# EAGLE design uServer-2.2 (EAGLE 6.5.0)
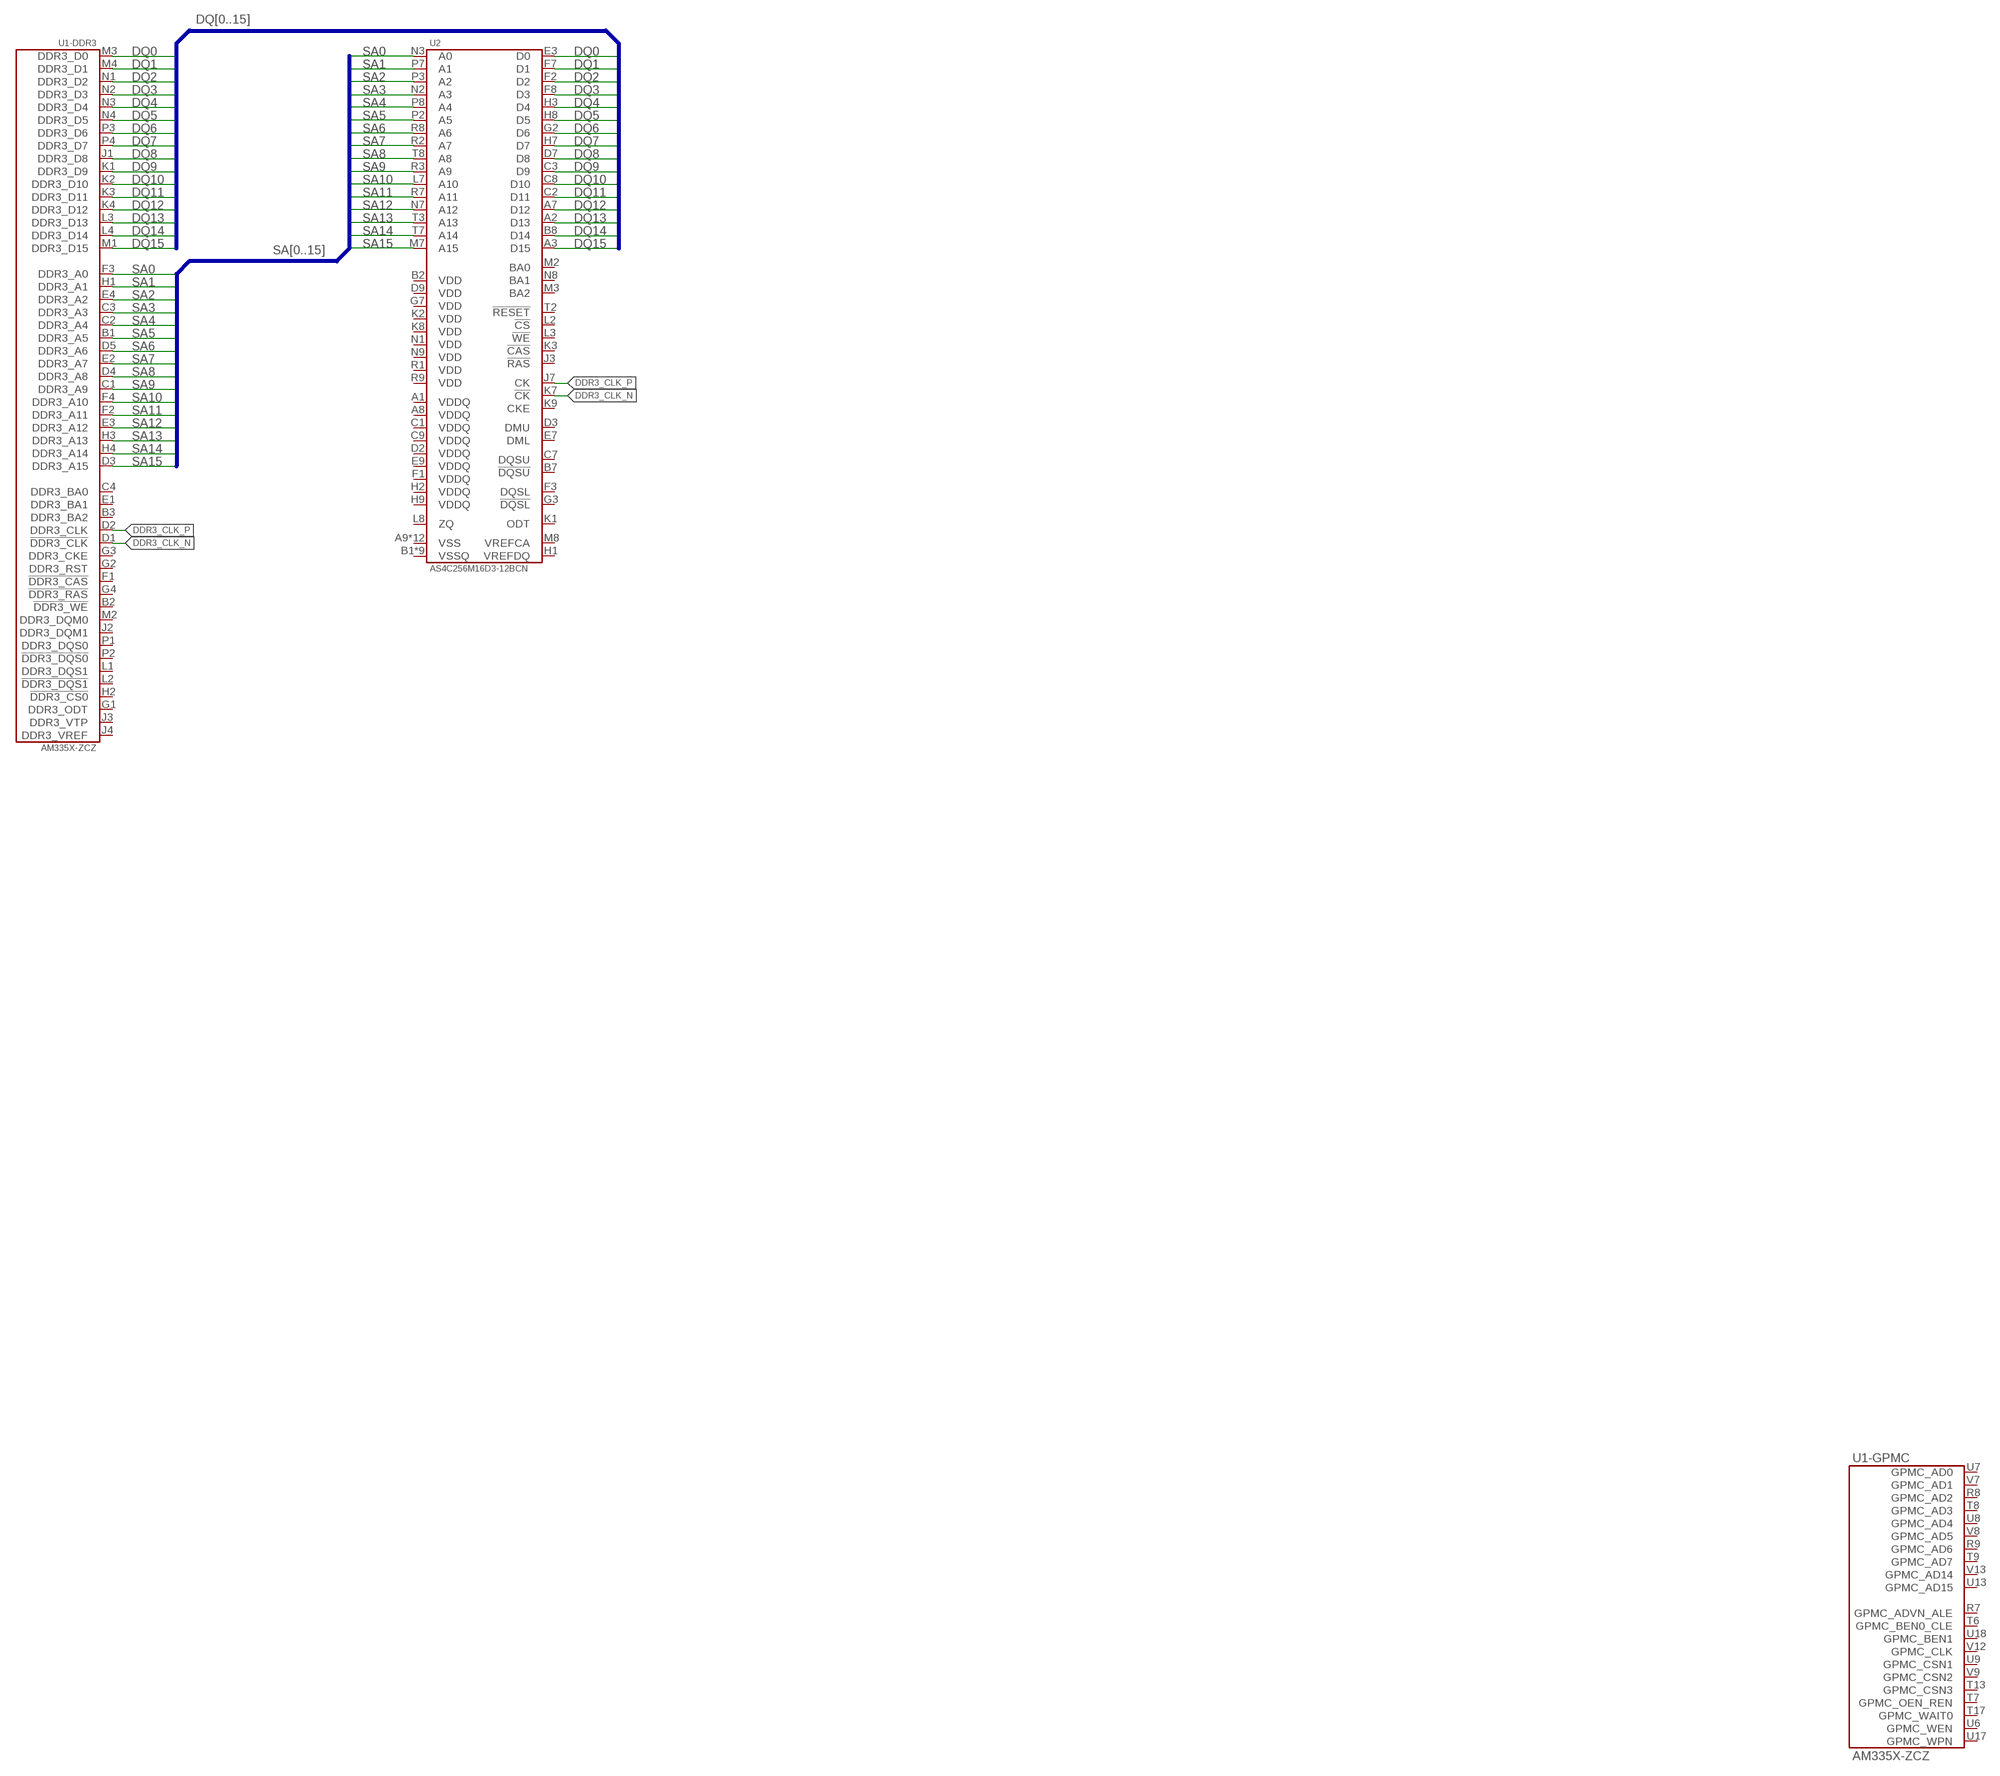
[diagram p0: schematic, sheet 1, part 1 of 2]
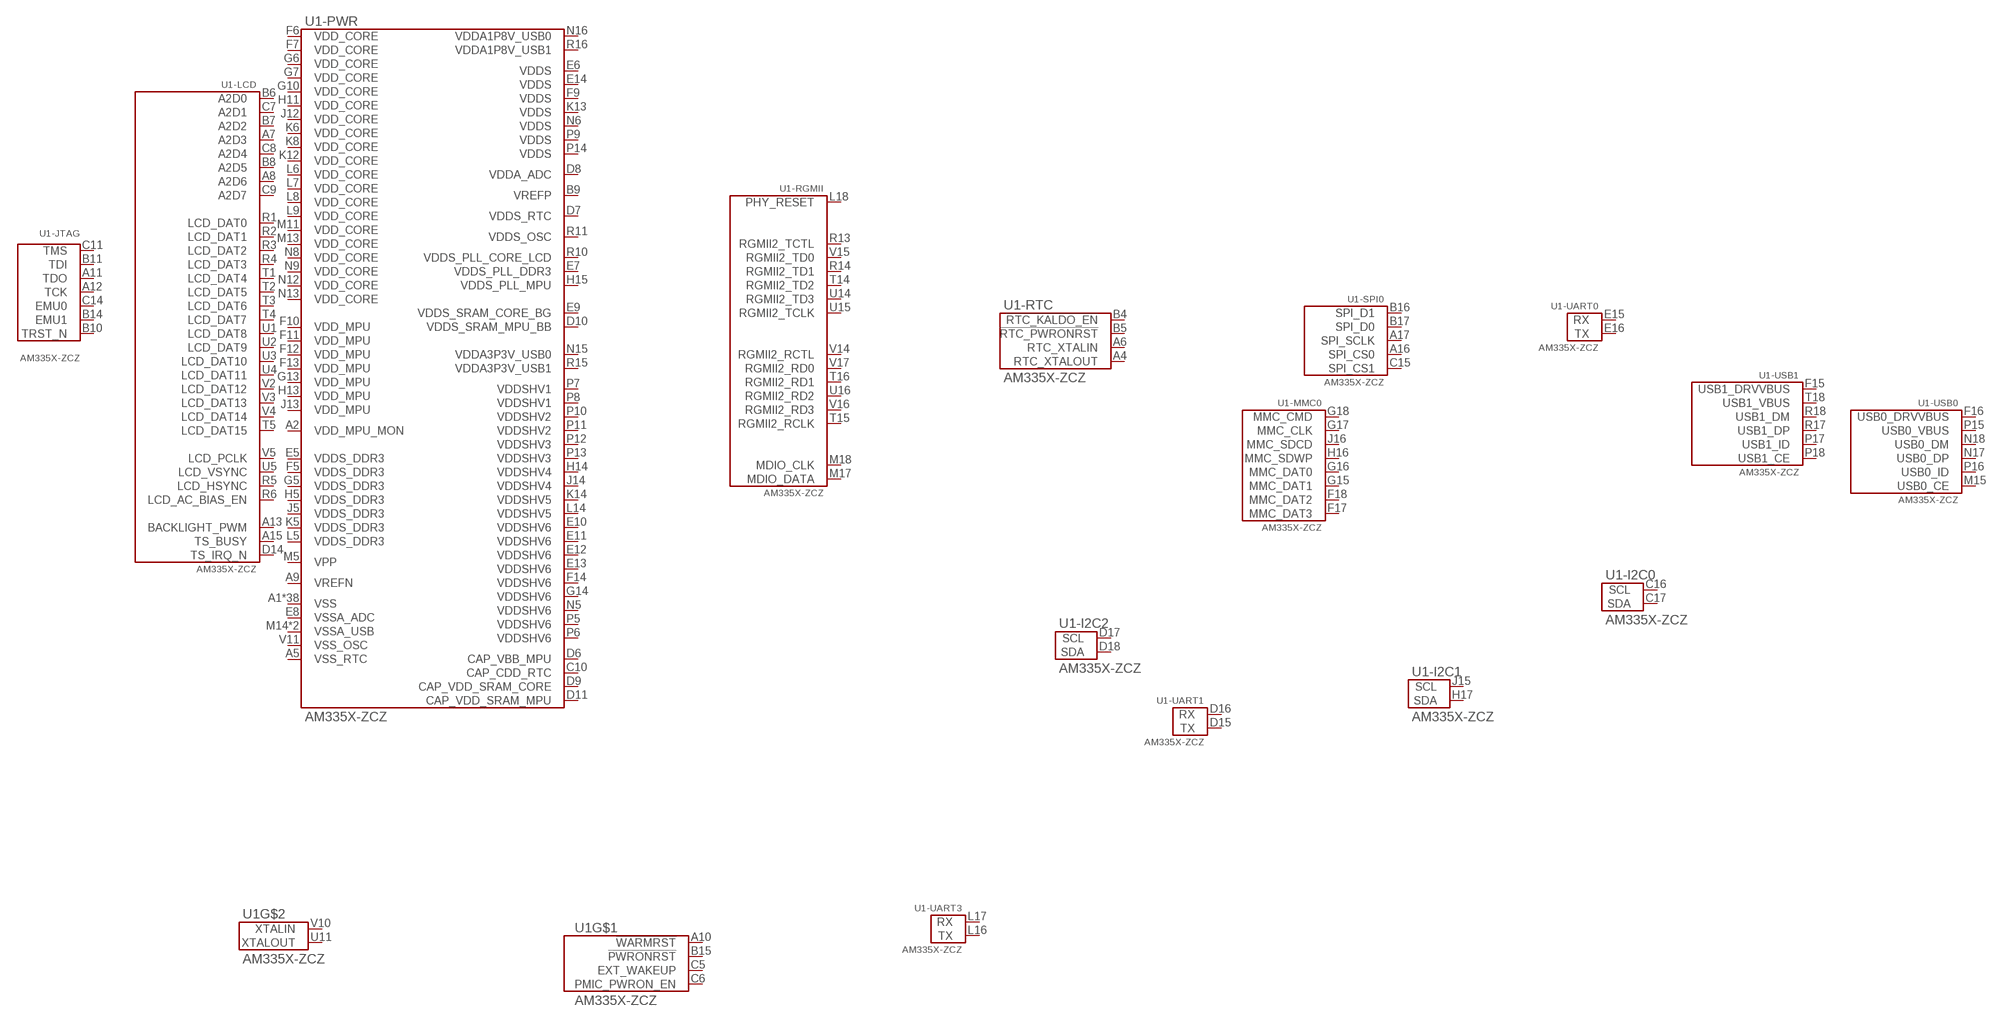
[diagram p1: schematic, sheet 1, part 2 of 2]

## Parts
U1  AM335X-ZCZ  [AM335X-ZCZ]
U2  AS4C256M16D3-12BCN  [DDR3-16]

## Nets
DDR3_CLK_N: U1.D1(-DDR3:!DDR3_CLK) U2.K7(!CK)
DDR3_CLK_P: U1.D2(-DDR3:DDR3_CLK) U2.J7(CK)
DQ0: U1.M3(-DDR3:DDR3_D0) U2.E3(D0)
DQ1: U1.M4(-DDR3:DDR3_D1) U2.F7(D1)
DQ2: U1.N1(-DDR3:DDR3_D2) U2.F2(D2)
DQ3: U1.N2(-DDR3:DDR3_D3) U2.F8(D3)
DQ4: U1.N3(-DDR3:DDR3_D4) U2.H3(D4)
DQ5: U1.N4(-DDR3:DDR3_D5) U2.H8(D5)
DQ6: U1.P3(-DDR3:DDR3_D6) U2.G2(D6)
DQ7: U1.P4(-DDR3:DDR3_D7) U2.H7(D7)
DQ8: U1.J1(-DDR3:DDR3_D8) U2.D7(D8)
DQ9: U1.K1(-DDR3:DDR3_D9) U2.C3(D9)
DQ10: U1.K2(-DDR3:DDR3_D10) U2.C8(D10)
DQ11: U1.K3(-DDR3:DDR3_D11) U2.C2(D11)
DQ12: U1.K4(-DDR3:DDR3_D12) U2.A7(D12)
DQ13: U1.L3(-DDR3:DDR3_D13) U2.A2(D13)
DQ14: U1.L4(-DDR3:DDR3_D14) U2.B8(D14)
DQ15: U1.M1(-DDR3:DDR3_D15) U2.A3(D15)
SA0: U1.F3(-DDR3:DDR3_A0) U2.N3(A0)
SA1: U1.H1(-DDR3:DDR3_A1) U2.P7(A1)
SA2: U1.E4(-DDR3:DDR3_A2) U2.P3(A2)
SA3: U1.C3(-DDR3:DDR3_A3) U2.N2(A3)
SA4: U1.C2(-DDR3:DDR3_A4) U2.P8(A4)
SA5: U1.B1(-DDR3:DDR3_A5) U2.P2(A5)
SA6: U1.D5(-DDR3:DDR3_A6) U2.R8(A6)
SA7: U1.E2(-DDR3:DDR3_A7) U2.R2(A7)
SA8: U1.D4(-DDR3:DDR3_A8) U2.T8(A8)
SA9: U1.C1(-DDR3:DDR3_A9) U2.R3(A9)
SA10: U1.F4(-DDR3:DDR3_A10) U2.L7(A10)
SA11: U1.F2(-DDR3:DDR3_A11) U2.R7(A11)
SA12: U1.E3(-DDR3:DDR3_A12) U2.N7(A12)
SA13: U1.H3(-DDR3:DDR3_A13) U2.T3(A13)
SA14: U1.H4(-DDR3:DDR3_A14) U2.T7(A14)
SA15: U1.D3(-DDR3:DDR3_A15) U2.M7(A15)
Unconnected: U1.A1(-PWR:VSS) U1.A2(-PWR:VDD_MPU_MON) U1.A4(-RTC:RTC_XTALOUT) U1.A5(-PWR:VSS_RTC) U1.A6(-RTC:RTC_XTALIN) U1.A7(-LCD:A2D3) U1.A8(-LCD:A2D6) U1.A9(-PWR:VREFN) U1.A10(!WARMRST) U1.A11(-JTAG:TDO) U1.A12(-JTAG:TCK) U1.A13(-LCD:BACKLIGHT_PWM) U1.A15(-LCD:TS_BUSY) U1.A16(-SPI0:SPI_CS0) U1.A17(-SPI0:SPI_SCLK) U1.A18(-PWR:VSS) U1.B2(-DDR3:!DDR3_WE) U1.B3(-DDR3:DDR3_BA2) U1.B4(-RTC:!RTC_KALDO_EN) U1.B5(-RTC:!RTC_PWRONRST) U1.B6(-LCD:A2D0) U1.B7(-LCD:A2D2) U1.B8(-LCD:A2D5) U1.B9(-PWR:VREFP) U1.B10(-JTAG:TRST_N) U1.B11(-JTAG:TDI) U1.B14(-JTAG:EMU1) U1.B15(!PWRONRST) U1.B16(-SPI0:SPI_D1) U1.B17(-SPI0:SPI_D0) U1.C4(-DDR3:DDR3_BA0) U1.C5(EXT_WAKEUP) U1.C6(PMIC_PWRON_EN) U1.C7(-LCD:A2D1) U1.C8(-LCD:A2D4) U1.C9(-LCD:A2D7) U1.C10(-PWR:CAP_CDD_RTC) U1.C11(-JTAG:TMS) U1.C14(-JTAG:EMU0) U1.C15(-SPI0:SPI_CS1) U1.C16(-I2C0:SCL) U1.C17(-I2C0:SDA) U1.D6(-PWR:CAP_VBB_MPU) U1.D7(-PWR:VDDS_RTC) U1.D8(-PWR:VDDA_ADC) U1.D9(-PWR:CAP_VDD_SRAM_CORE) U1.D10(-PWR:VDDS_SRAM_MPU_BB) U1.D11(-PWR:CAP_VDD_SRAM_MPU) U1.D14(-LCD:TS_IRQ_N) U1.D15(-UART1:TX) U1.D16(-UART1:RX) U1.D17(-I2C2:SCL) U1.D18(-I2C2:SDA) U1.E1(-DDR3:DDR3_BA1) U1.E5(-PWR:VDDS_DDR3) U1.E6(-PWR:VDDS) U1.E7(-PWR:VDDS_PLL_DDR3) U1.E8(-PWR:VSSA_ADC) U1.E9(-PWR:VDDS_SRAM_CORE_BG) U1.E10(-PWR:VDDSHV6) U1.E11(-PWR:VDDSHV6) U1.E12(-PWR:VDDSHV6) U1.E13(-PWR:VDDSHV6) U1.E14(-PWR:VDDS) U1.E15(-UART0:RX) U1.E16(-UART0:TX) U1.F1(-DDR3:!DDR3_CAS) U1.F5(-PWR:VDDS_DDR3) U1.F6(-PWR:VDD_CORE) U1.F7(-PWR:VDD_CORE) U1.F8(-PWR:VSS) U1.F9(-PWR:VDDS) U1.F10(-PWR:VDD_MPU) U1.F11(-PWR:VDD_MPU) U1.F12(-PWR:VDD_MPU) U1.F13(-PWR:VDD_MPU) U1.F14(-PWR:VDDSHV6) U1.F15(-USB1:USB1_DRVVBUS) U1.F16(-USB0:USB0_DRVVBUS) U1.F17(-MMC0:MMC_DAT3) U1.F18(-MMC0:MMC_DAT2) U1.G1(-DDR3:DDR3_ODT) U1.G2(-DDR3:DDR3_RST) U1.G3(-DDR3:DDR3_CKE) U1.G4(-DDR3:!DDR3_RAS) U1.G5(-PWR:VDDS_DDR3) U1.G6(-PWR:VDD_CORE) U1.G7(-PWR:VDD_CORE) U1.G8(-PWR:VSS) U1.G9(-PWR:VSS) U1.G10(-PWR:VDD_CORE) U1.G11(-PWR:VSS) U1.G12(-PWR:VSS) U1.G13(-PWR:VDD_MPU) U1.G14(-PWR:VDDSHV6) U1.G15(-MMC0:MMC_DAT1) U1.G16(-MMC0:MMC_DAT0) U1.G17(-MMC0:MMC_CLK) U1.G18(-MMC0:MMC_CMD) U1.H2(-DDR3:!DDR3_CS0) U1.H5(-PWR:VDDS_DDR3) U1.H6(-PWR:VSS) U1.H7(-PWR:VSS) U1.H8(-PWR:VSS) U1.H9(-PWR:VSS) U1.H10(-PWR:VSS) U1.H11(-PWR:VDD_CORE) U1.H12(-PWR:VSS) U1.H13(-PWR:VDD_MPU) U1.H14(-PWR:VDDSHV4) U1.H15(-PWR:VDDS_PLL_MPU) U1.H16(-MMC0:MMC_SDWP) U1.H17(-I2C1:SDA) U1.J2(-DDR3:DDR3_DQM1) U1.J3(-DDR3:DDR3_VTP) U1.J4(-DDR3:DDR3_VREF) U1.J5(-PWR:VDDS_DDR3) U1.J6(-PWR:VSS) U1.J7(-PWR:VSS) U1.J8(-PWR:VSS) U1.J9(-PWR:VSS) U1.J10(-PWR:VSS) U1.J11(-PWR:VSS) U1.J12(-PWR:VDD_CORE) U1.J13(-PWR:VDD_MPU) U1.J14(-PWR:VDDSHV4) U1.J15(-I2C1:SCL) U1.J16(-MMC0:MMC_SDCD) U1.K5(-PWR:VDDS_DDR3) U1.K6(-PWR:VDD_CORE) U1.K7(-PWR:VSS) U1.K8(-PWR:VDD_CORE) U1.K9(-PWR:VSS) U1.K10(-PWR:VSS) U1.K11(-PWR:VSS) U1.K12(-PWR:VDD_CORE) U1.K13(-PWR:VDDS) U1.K14(-PWR:VDDSHV5) U1.L1(-DDR3:DDR3_DQS1) U1.L2(-DDR3:!DDR3_DQS1) U1.L5(-PWR:VDDS_DDR3) U1.L6(-PWR:VDD_CORE) U1.L7(-PWR:VDD_CORE) U1.L8(-PWR:VDD_CORE) U1.L9(-PWR:VDD_CORE) U1.L10(-PWR:VSS) U1.L11(-PWR:VSS) U1.L12(-PWR:VSS) U1.L13(-PWR:VSS) U1.L14(-PWR:VDDSHV5) U1.L16(-UART3:TX) U1.L17(-UART3:RX) U1.L18(-RGMII:PHY_RESET) U1.M2(-DDR3:DDR3_DQM0) U1.M5(-PWR:VPP) U1.M6(-PWR:VSS) U1.M7(-PWR:VSS) U1.M8(-PWR:VSS) U1.M9(-PWR:VSS) U1.M10(-PWR:VSS) U1.M11(-PWR:VDD_CORE) U1.M12(-PWR:VSS) U1.M13(-PWR:VDD_CORE) U1.M14(-PWR:VSSA_USB) U1.M15(-USB0:USB0_CE) U1.M17(-RGMII:MDIO_DATA) U1.M18(-RGMII:MDIO_CLK) U1.N5(-PWR:VDDSHV6) U1.N6(-PWR:VDDS) U1.N7(-PWR:VSS) U1.N8(-PWR:VDD_CORE) U1.N9(-PWR:VDD_CORE) U1.N10(-PWR:VSS) U1.N11(-PWR:VSS) U1.N12(-PWR:VDD_CORE) U1.N13(-PWR:VDD_CORE) U1.N14(-PWR:VSSA_USB) U1.N15(-PWR:VDDA3P3V_USB0) U1.N16(-PWR:VDDA1P8V_USB0) U1.N17(-USB0:USB0_DP) U1.N18(-USB0:USB0_DM) U1.P1(-DDR3:DDR3_DQS0) U1.P2(-DDR3:!DDR3_DQS0) U1.P5(-PWR:VDDSHV6) U1.P6(-PWR:VDDSHV6) U1.P7(-PWR:VDDSHV1) U1.P8(-PWR:VDDSHV1) U1.P9(-PWR:VDDS) U1.P10(-PWR:VDDSHV2) U1.P11(-PWR:VDDSHV2) U1.P12(-PWR:VDDSHV3) U1.P13(-PWR:VDDSHV3) U1.P14(-PWR:VDDS) U1.P15(-USB0:USB0_VBUS) U1.P16(-USB0:USB0_ID) U1.P17(-USB1:USB1_ID) U1.P18(-USB1:USB1_CE) U1.R1(-LCD:LCD_DAT0) U1.R2(-LCD:LCD_DAT1) U1.R3(-LCD:LCD_DAT2) U1.R4(-LCD:LCD_DAT3) U1.R5(-LCD:LCD_HSYNC) U1.R6(-LCD:LCD_AC_BIAS_EN) U1.R7(-GPMC:GPMC_ADVN_ALE) U1.R8(-GPMC:GPMC_AD2) U1.R9(-GPMC:GPMC_AD6) U1.R10(-PWR:VDDS_PLL_CORE_LCD) U1.R11(-PWR:VDDS_OSC) U1.R13(-RGMII:RGMII2_TCTL) U1.R14(-RGMII:RGMII2_TD1) U1.R15(-PWR:VDDA3P3V_USB1) U1.R16(-PWR:VDDA1P8V_USB1) U1.R17(-USB1:USB1_DP) U1.R18(-USB1:USB1_DM) U1.T1(-LCD:LCD_DAT4) U1.T2(-LCD:LCD_DAT5) U1.T3(-LCD:LCD_DAT6) U1.T4(-LCD:LCD_DAT7) U1.T5(-LCD:LCD_DAT15) U1.T6(-GPMC:GPMC_BEN0_CLE) U1.T7(-GPMC:GPMC_OEN_REN) U1.T8(-GPMC:GPMC_AD3) U1.T9(-GPMC:GPMC_AD7) U1.T13(-GPMC:GPMC_CSN3) U1.T14(-RGMII:RGMII2_TD2) U1.T15(-RGMII:RGMII2_RCLK) U1.T16(-RGMII:RGMII2_RD1) U1.T17(-GPMC:GPMC_WAIT0) U1.T18(-USB1:USB1_VBUS) U1.U1(-LCD:LCD_DAT8) U1.U2(-LCD:LCD_DAT9) U1.U3(-LCD:LCD_DAT10) U1.U4(-LCD:LCD_DAT11) U1.U5(-LCD:LCD_VSYNC) U1.U6(-GPMC:GPMC_WEN) U1.U7(-GPMC:GPMC_AD0) U1.U8(-GPMC:GPMC_AD4) U1.U9(-GPMC:GPMC_CSN1) U1.U11(XTALOUT) U1.U13(-GPMC:GPMC_AD15) U1.U14(-RGMII:RGMII2_TD3) U1.U15(-RGMII:RGMII2_TCLK) U1.U16(-RGMII:RGMII2_RD2) U1.U17(-GPMC:GPMC_WPN) U1.U18(-GPMC:GPMC_BEN1) U1.V1(-PWR:VSS) U1.V2(-LCD:LCD_DAT12) U1.V3(-LCD:LCD_DAT13) U1.V4(-LCD:LCD_DAT14) U1.V5(-LCD:LCD_PCLK) U1.V7(-GPMC:GPMC_AD1) U1.V8(-GPMC:GPMC_AD5) U1.V9(-GPMC:GPMC_CSN2) U1.V10(XTALIN) U1.V11(-PWR:VSS_OSC) U1.V12(-GPMC:GPMC_CLK) U1.V13(-GPMC:GPMC_AD14) U1.V14(-RGMII:RGMII2_RCTL) U1.V15(-RGMII:RGMII2_TD0) U1.V16(-RGMII:RGMII2_RD3) U1.V17(-RGMII:RGMII2_RD0) U1.V18(-PWR:VSS) U2.A1(VDDQ) U2.A8(VDDQ) U2.A9(VSS) U2.B1(VSSQ) U2.B2(VDD) U2.B3(VSS) U2.B7(!DQSU) U2.B9(VSSQ) U2.C1(VDDQ) U2.C7(DQSU) U2.C9(VDDQ) U2.D1(VSSQ) U2.D2(VDDQ) U2.D3(DMU) U2.D8(VSSQ) U2.D9(VDD) U2.E1(VSS) U2.E2(VSSQ) U2.E7(DML) U2.E8(VSSQ) U2.E9(VDDQ) U2.F1(VDDQ) U2.F3(DQSL) U2.F9(VSSQ) U2.G1(VSSQ) U2.G3(!DQSL) U2.G7(VDD) U2.G8(VSS) U2.G9(VSSQ) U2.H1(VREFDQ) U2.H2(VDDQ) U2.H9(VDDQ) U2.J2(VSS) U2.J3(!RAS) U2.J8(VSS) U2.K1(ODT) U2.K2(VDD) U2.K3(!CAS) U2.K8(VDD) U2.K9(CKE) U2.L2(!CS) U2.L3(!WE) U2.L8(ZQ) U2.M1(VSS) U2.M2(BA0) U2.M3(BA2) U2.M8(VREFCA) U2.M9(VSS) U2.N1(VDD) U2.N8(BA1) U2.N9(VDD) U2.P1(VSS) U2.P9(VSS) U2.R1(VDD) U2.R9(VDD) U2.T1(VSS) U2.T2(!RESET) U2.T9(VSS)

## Buses
DQ[0..15]
SA[0..15]

## Library data of the parts
U1 = TI:AM335X
U2 = AllianceMemory:AS4C256M16D3

## Board
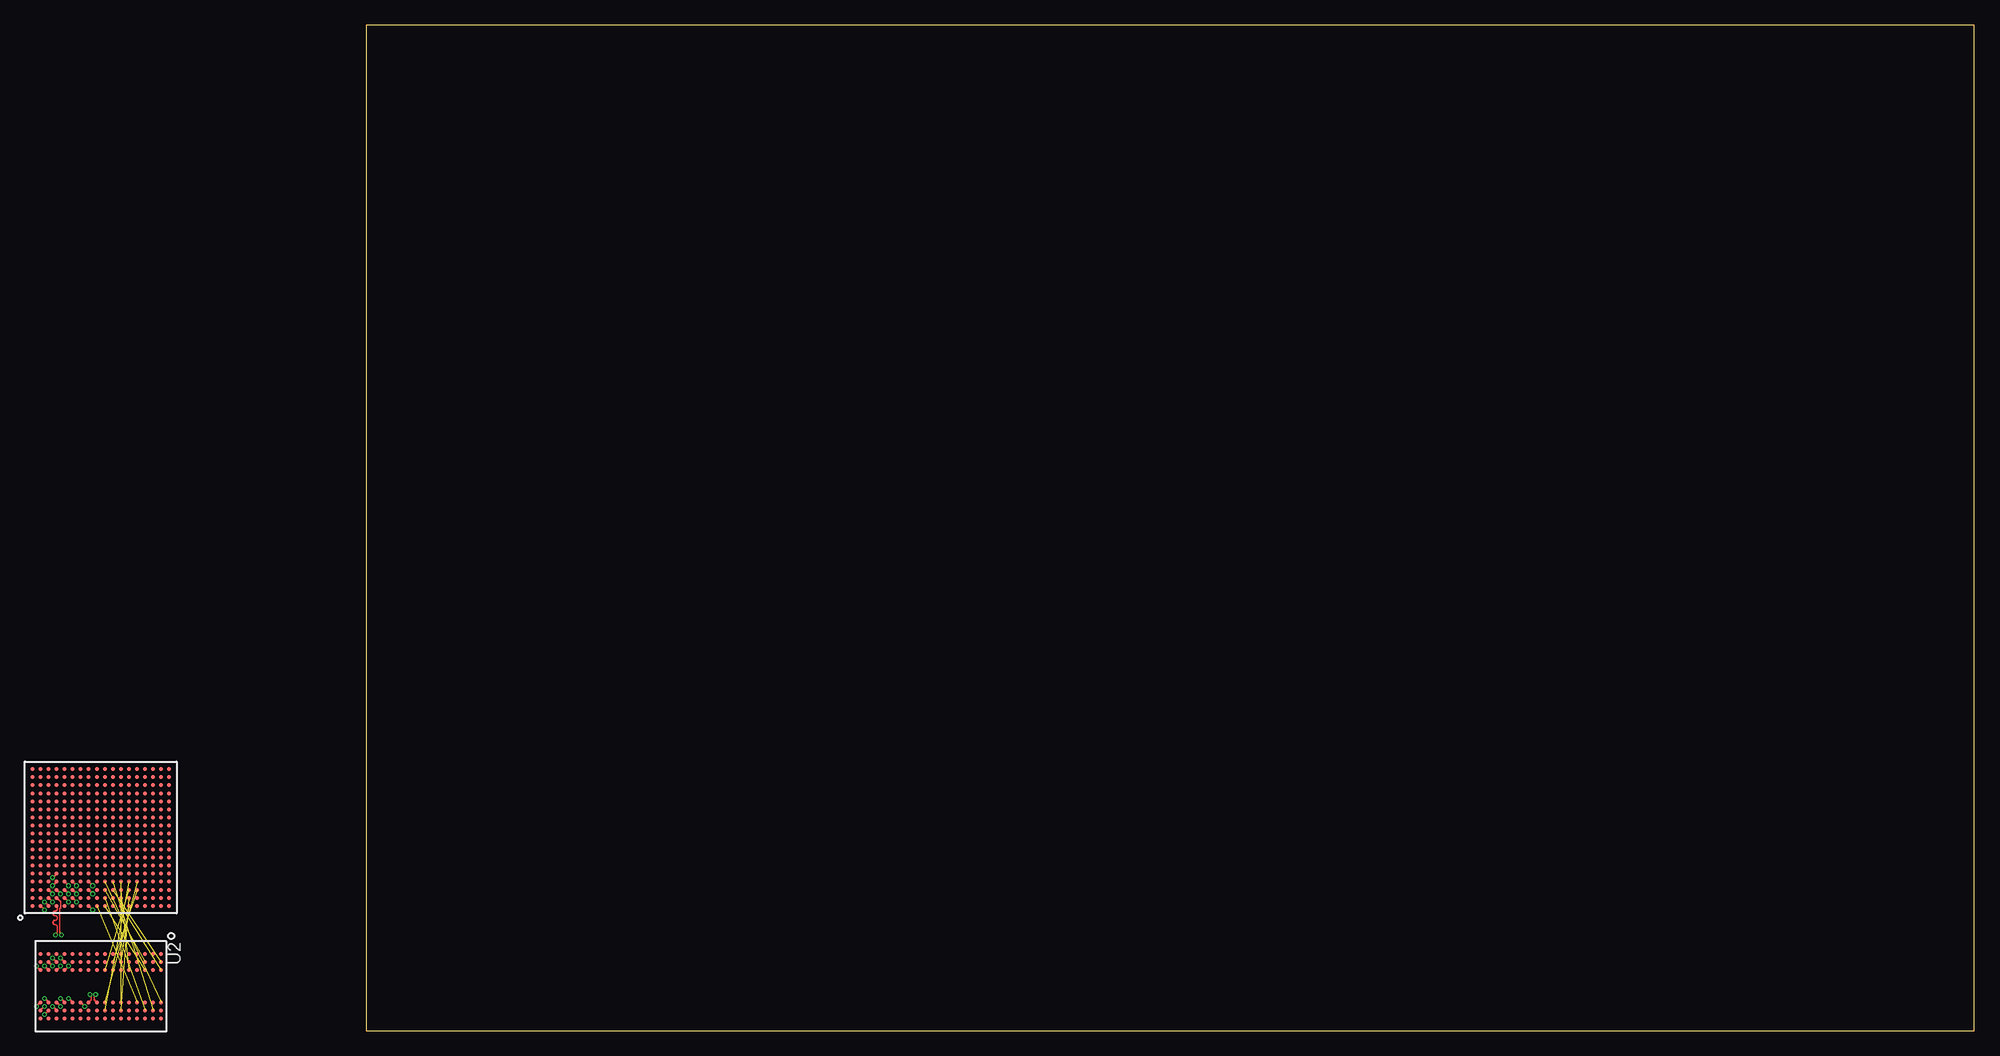
[diagram p2: board, top side]
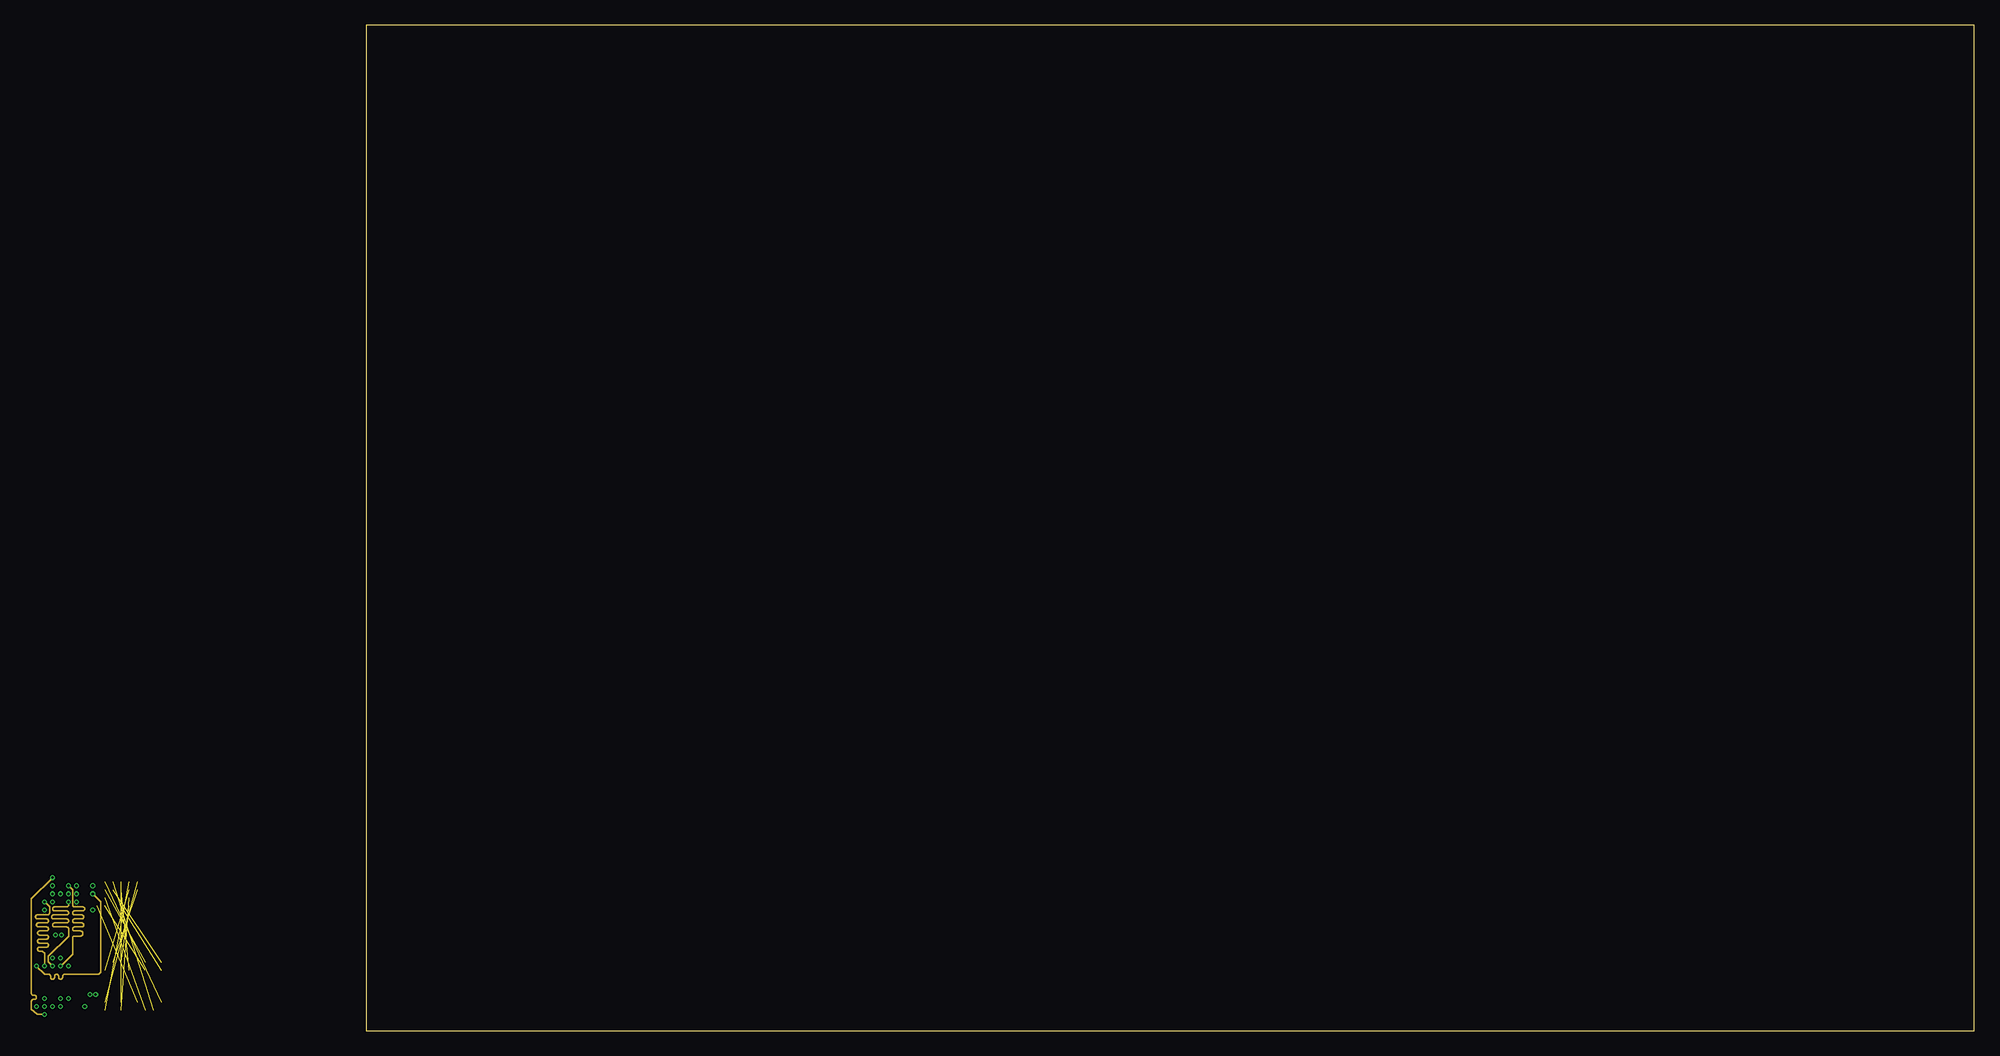
[diagram p3: board, inner layer Route2]
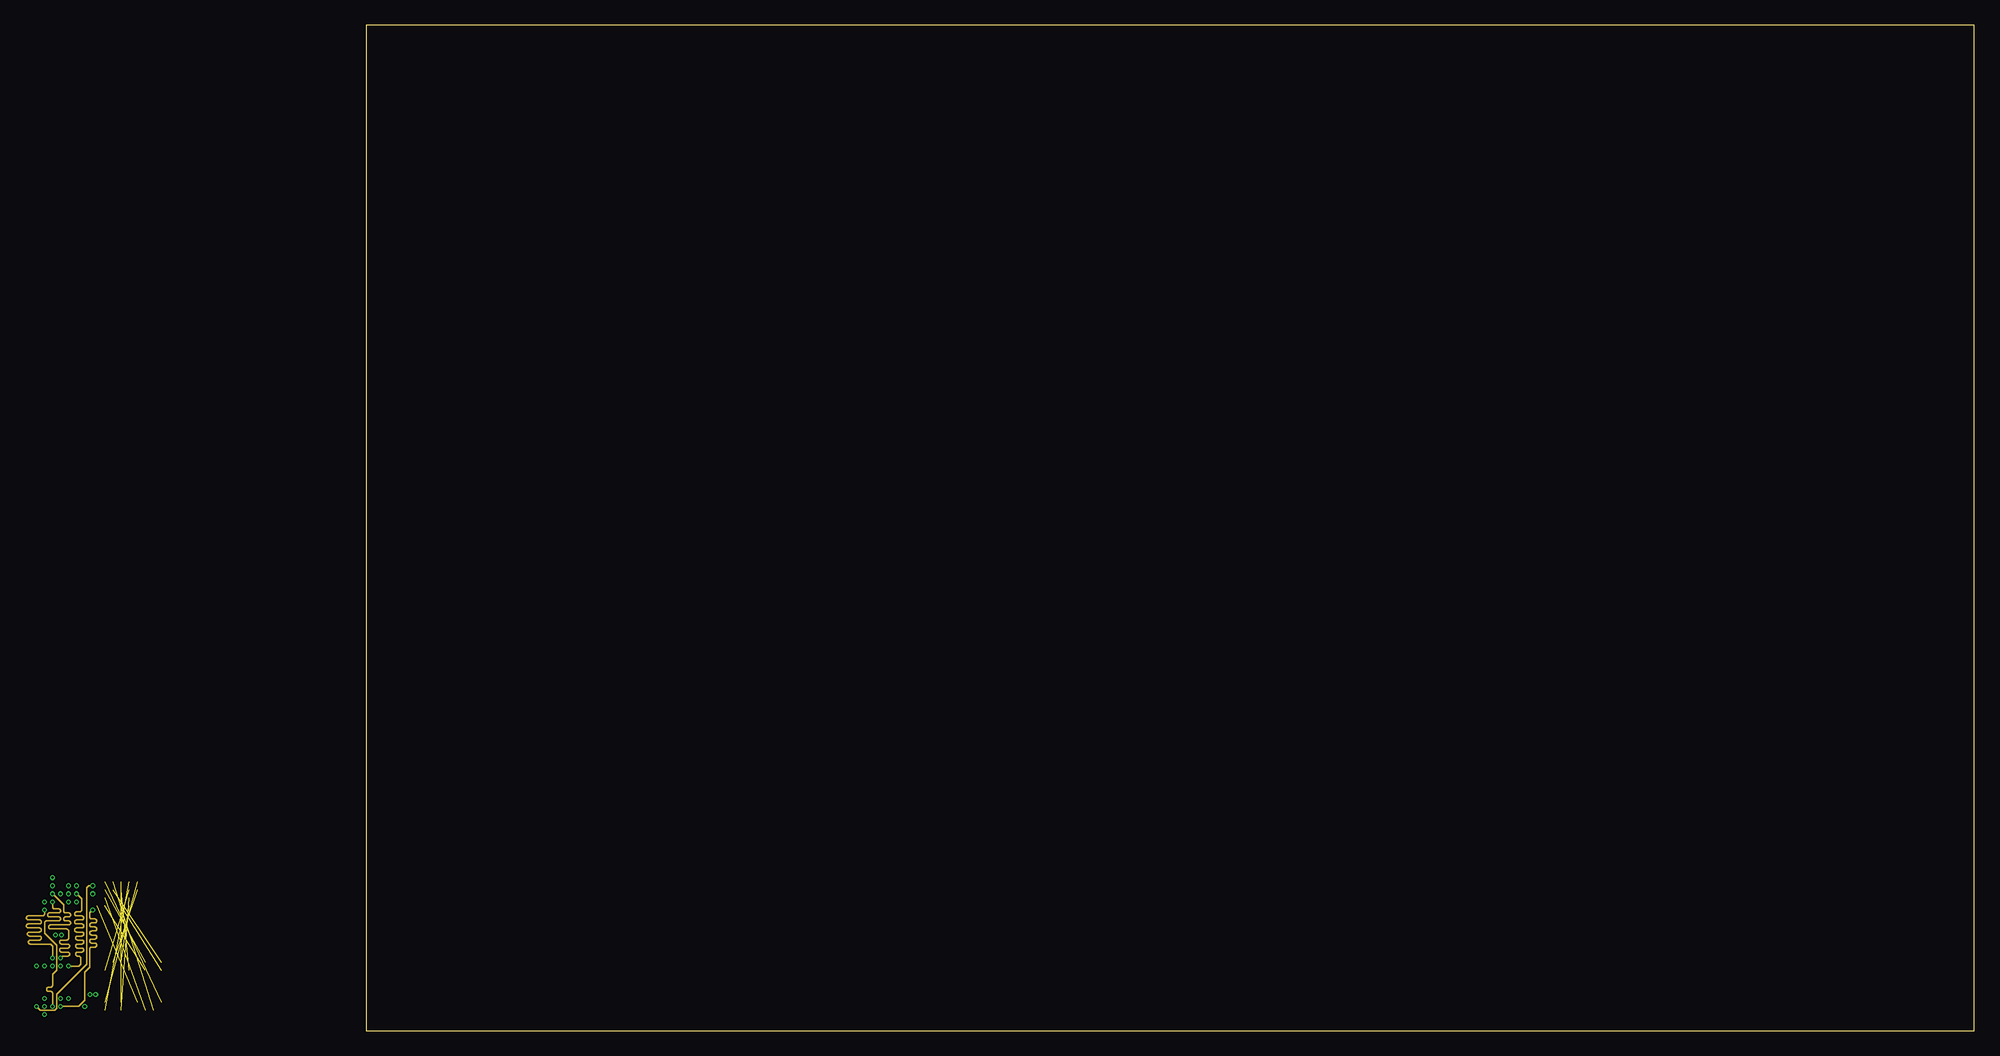
[diagram p4: board, inner layer Route15]
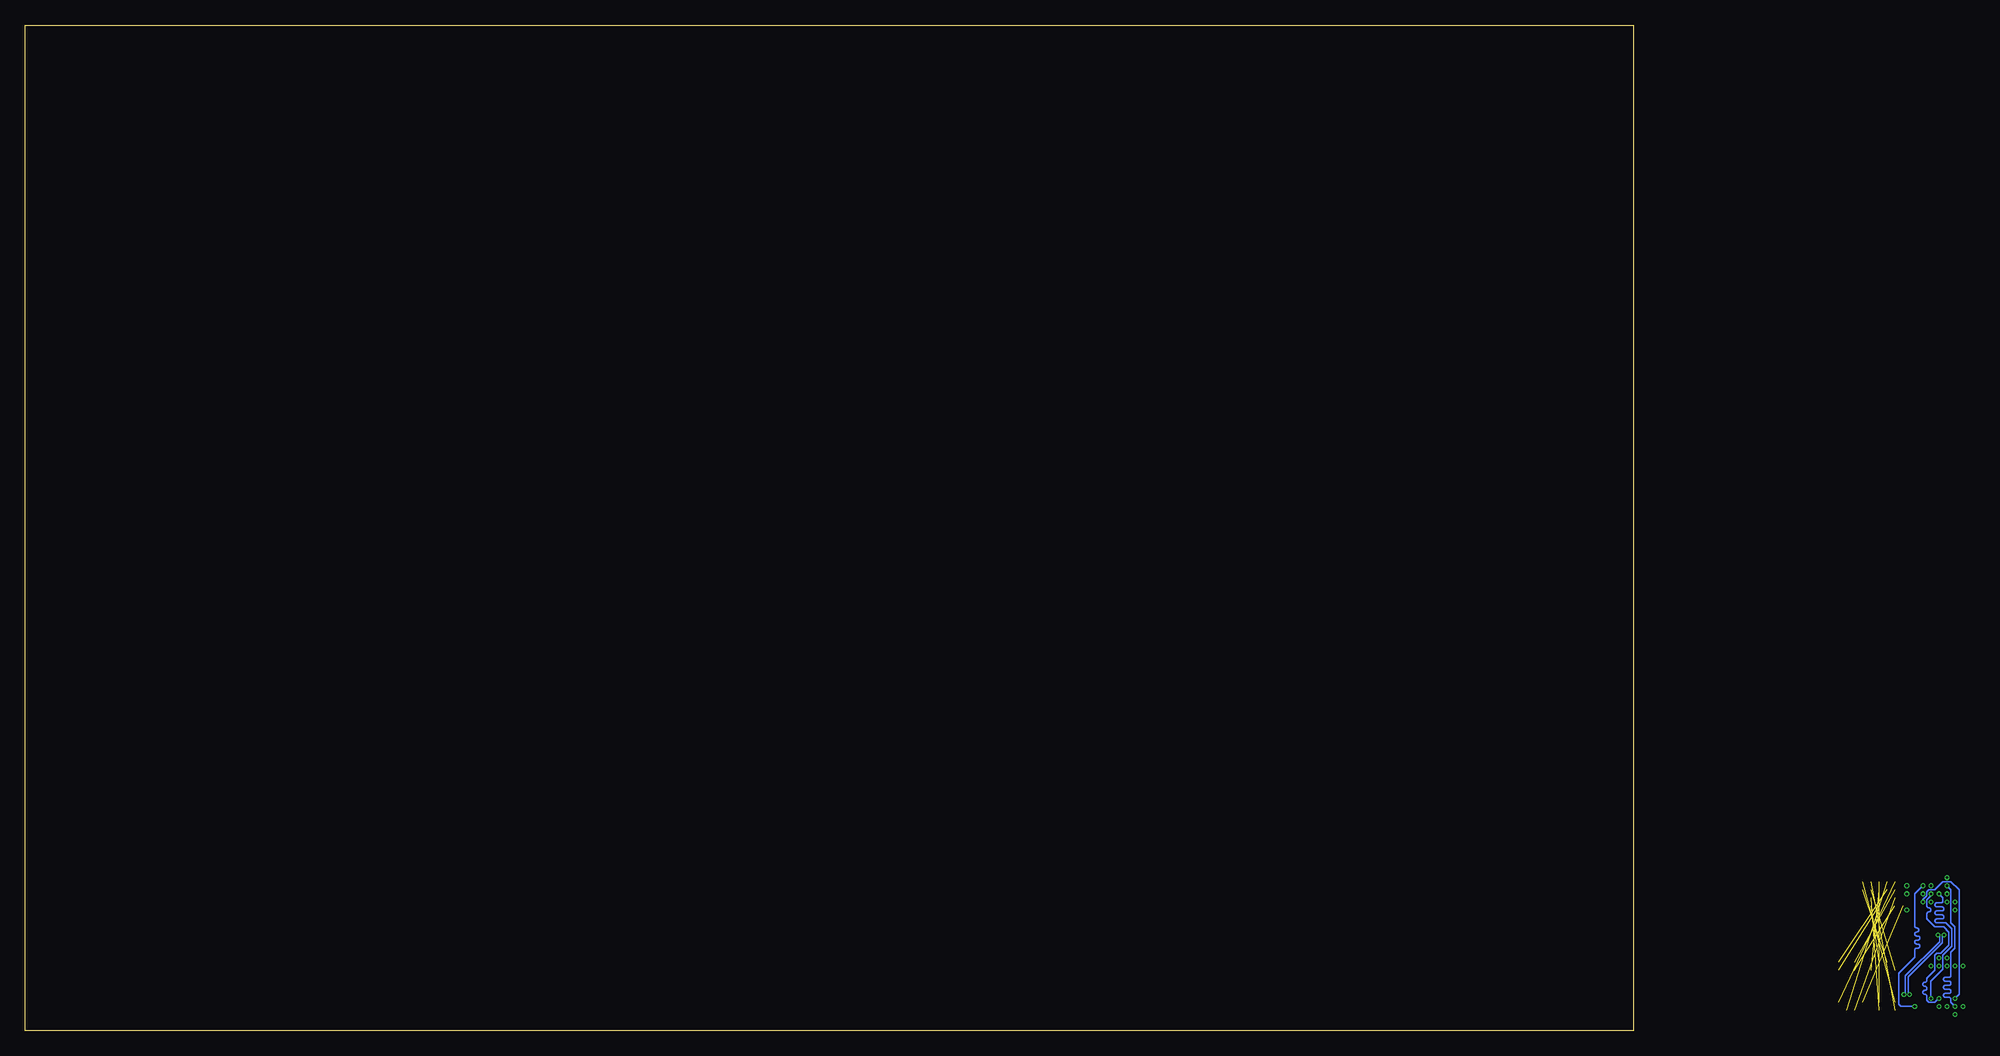
[diagram p5: board, bottom side, seen from below]

Size 160 x 100 mm. Coordinates in mm from the lower left corner, seen from the top.
Outline: 0,0 160,0 160,100 0,100 0,0
Copper layers (1*2*15*16): Top 0.035559375mm / dielectric 0.17018125mm / Route2 0.01778125mm / dielectric 47mil / Route15 0.01778125mm / dielectric 0.17018125mm / Bottom 0.035559375mm
Design rules "OSHPark-4layer *": minimum track width 5mil, minimum drill 10mil, track to track 5mil, track to pad 5mil, pad to pad 5mil, via to via 5mil, smd to smd 5mil, copper to edge 15mil, drill to drill 6mil, minimum pad ring 4mil, minimum via ring 4mil, stop-mask expansion 4mil, vias tented up to drill 20mil, thermal gap 10mil

### Footprints (pad centres in the part's own frame; a part is rotated, then mirrored left to right if it is on the bottom)
AM335X-ZCZ = smd 0.4 x 0.4: A1 -6.8,6.8; A2 -6,6.8; A3 -5.2,6.8; A4 -4.4,6.8; A5 -3.6,6.8; A6 -2.8,6.8; A7 -2,6.8; A8 -1.2,6.8; A9 -0.4,6.8; A10 0.4,6.8; A11 1.2,6.8; A12 2,6.8; A13 2.8,6.8; A14 3.6,6.8; A15 4.4,6.8; A16 5.2,6.8; A17 6,6.8; A18 6.8,6.8; B1 -6.8,6; B2 -6,6; B3 -5.2,6; B4 -4.4,6; B5 -3.6,6; B6 -2.8,6; B7 -2,6; B8 -1.2,6; B9 -0.4,6; B10 0.4,6; B11 1.2,6; B12 2,6; B13 2.8,6; B14 3.6,6; B15 4.4,6; B16 5.2,6; B17 6,6; B18 6.8,6; C1 -6.8,5.2; C2 -6,5.2; C3 -5.2,5.2; C4 -4.4,5.2; C5 -3.6,5.2; C6 -2.8,5.2; C7 -2,5.2; C8 -1.2,5.2; C9 -0.4,5.2; C10 0.4,5.2; C11 1.2,5.2; C12 2,5.2; C13 2.8,5.2; C14 3.6,5.2; C15 4.4,5.2; C16 5.2,5.2; C17 6,5.2; C18 6.8,5.2; D1 -6.8,4.4; D2 -6,4.4; D3 -5.2,4.4; D4 -4.4,4.4; D5 -3.6,4.4; D6 -2.8,4.4; D7 -2,4.4; D8 -1.2,4.4; D9 -0.4,4.4; D10 0.4,4.4; D11 1.2,4.4; D12 2,4.4; D13 2.8,4.4; D14 3.6,4.4; D15 4.4,4.4; D16 5.2,4.4; D17 6,4.4; D18 6.8,4.4; E1 -6.8,3.6; E2 -6,3.6; E3 -5.2,3.6; E4 -4.4,3.6; E5 -3.6,3.6; E6 -2.8,3.6; E7 -2,3.6; E8 -1.2,3.6; E9 -0.4,3.6; E10 0.4,3.6; E11 1.2,3.6; E12 2,3.6; E13 2.8,3.6; E14 3.6,3.6; E15 4.4,3.6; E16 5.2,3.6; E17 6,3.6; E18 6.8,3.6; F1 -6.8,2.8; F2 -6,2.8; F3 -5.2,2.8; F4 -4.4,2.8; F5 -3.6,2.8; F6 -2.8,2.8; F7 -2,2.8; F8 -1.2,2.8; F9 -0.4,2.8; F10 0.4,2.8; F11 1.2,2.8; F12 2,2.8; F13 2.8,2.8; F14 3.6,2.8; F15 4.4,2.8; F16 5.2,2.8; F17 6,2.8; F18 6.8,2.8; G1 -6.8,2; G2 -6,2; G3 -5.2,2; G4 -4.4,2; G5 -3.6,2; G6 -2.8,2; G7 -2,2; G8 -1.2,2; G9 -0.4,2; G10 0.4,2; G11 1.2,2; G12 2,2; G13 2.8,2; G14 3.6,2; G15 4.4,2; G16 5.2,2; G17 6,2; G18 6.8,2; H1 -6.8,1.2; H2 -6,1.2; H3 -5.2,1.2; H4 -4.4,1.2; H5 -3.6,1.2; H6 -2.8,1.2; H7 -2,1.2; H8 -1.2,1.2; H9 -0.4,1.2; H10 0.4,1.2; H11 1.2,1.2; H12 2,1.2; H13 2.8,1.2; H14 3.6,1.2; H15 4.4,1.2; H16 5.2,1.2; H17 6,1.2; H18 6.8,1.2; J1 -6.8,0.4; J2 -6,0.4; J3 -5.2,0.4; J4 -4.4,0.4; J5 -3.6,0.4; J6 -2.8,0.4; J7 -2,0.4; J8 -1.2,0.4; J9 -0.4,0.4; J10 0.4,0.4; J11 1.2,0.4; J12 2,0.4; J13 2.8,0.4; J14 3.6,0.4; J15 4.4,0.4; J16 5.2,0.4; J17 6,0.4; J18 6.8,0.4; K1 -6.8,-0.4; K2 -6,-0.4; K3 -5.2,-0.4; K4 -4.4,-0.4; K5 -3.6,-0.4; K6 -2.8,-0.4; K7 -2,-0.4; K8 -1.2,-0.4; K9 -0.4,-0.4; K10 0.4,-0.4; K11 1.2,-0.4; K12 2,-0.4; K13 2.8,-0.4; K14 3.6,-0.4; K15 4.4,-0.4; K16 5.2,-0.4; K17 6,-0.4; K18 6.8,-0.4; L1 -6.8,-1.2; L2 -6,-1.2; L3 -5.2,-1.2; L4 -4.4,-1.2; L5 -3.6,-1.2; L6 -2.8,-1.2; L7 -2,-1.2; L8 -1.2,-1.2; L9 -0.4,-1.2; L10 0.4,-1.2; L11 1.2,-1.2; L12 2,-1.2; L13 2.8,-1.2; L14 3.6,-1.2; L15 4.4,-1.2; L16 5.2,-1.2; L17 6,-1.2; L18 6.8,-1.2; M1 -6.8,-2; M2 -6,-2; M3 -5.2,-2; M4 -4.4,-2; M5 -3.6,-2; M6 -2.8,-2; M7 -2,-2; M8 -1.2,-2; M9 -0.4,-2; M10 0.4,-2; M11 1.2,-2; M12 2,-2; M13 2.8,-2; M14 3.6,-2; M15 4.4,-2; M16 5.2,-2; M17 6,-2; M18 6.8,-2; N1 -6.8,-2.8; N2 -6,-2.8; N3 -5.2,-2.8; N4 -4.4,-2.8; N5 -3.6,-2.8; N6 -2.8,-2.8; N7 -2,-2.8; N8 -1.2,-2.8; N9 -0.4,-2.8; N10 0.4,-2.8; N11 1.2,-2.8; N12 2,-2.8; N13 2.8,-2.8; N14 3.6,-2.8; N15 4.4,-2.8; N16 5.2,-2.8; N17 6,-2.8; N18 6.8,-2.8; P1 -6.8,-3.6; P2 -6,-3.6; P3 -5.2,-3.6; P4 -4.4,-3.6; P5 -3.6,-3.6; P6 -2.8,-3.6; P7 -2,-3.6; P8 -1.2,-3.6; P9 -0.4,-3.6; P10 0.4,-3.6; P11 1.2,-3.6; P12 2,-3.6; P13 2.8,-3.6; P14 3.6,-3.6; P15 4.4,-3.6; P16 5.2,-3.6; P17 6,-3.6; P18 6.8,-3.6; R1 -6.8,-4.4; R2 -6,-4.4; R3 -5.2,-4.4; R4 -4.4,-4.4; R5 -3.6,-4.4; R6 -2.8,-4.4; R7 -2,-4.4; R8 -1.2,-4.4; R9 -0.4,-4.4; R10 0.4,-4.4; R11 1.2,-4.4; R12 2,-4.4; R13 2.8,-4.4; R14 3.6,-4.4; R15 4.4,-4.4; R16 5.2,-4.4; R17 6,-4.4; R18 6.8,-4.4; T1 -6.8,-5.2; T2 -6,-5.2; T3 -5.2,-5.2; T4 -4.4,-5.2; T5 -3.6,-5.2; T6 -2.8,-5.2; T7 -2,-5.2; T8 -1.2,-5.2; T9 -0.4,-5.2; T10 0.4,-5.2; T11 1.2,-5.2; T12 2,-5.2; T13 2.8,-5.2; T14 3.6,-5.2; T15 4.4,-5.2; T16 5.2,-5.2; T17 6,-5.2; T18 6.8,-5.2; U1 -6.8,-6; U2 -6,-6; U3 -5.2,-6; U4 -4.4,-6; U5 -3.6,-6; U6 -2.8,-6; U7 -2,-6; U8 -1.2,-6; U9 -0.4,-6; U10 0.4,-6; U11 1.2,-6; U12 2,-6; U13 2.8,-6; U14 3.6,-6; U15 4.4,-6; U16 5.2,-6; U17 6,-6; U18 6.8,-6; V1 -6.8,-6.8; V2 -6,-6.8; V3 -5.2,-6.8; V4 -4.4,-6.8; V5 -3.6,-6.8; V6 -2.8,-6.8; V7 -2,-6.8; V8 -1.2,-6.8; V9 -0.4,-6.8; V10 0.4,-6.8; V11 1.2,-6.8; V12 2,-6.8; V13 2.8,-6.8; V14 3.6,-6.8; V15 4.4,-6.8; V16 5.2,-6.8; V17 6,-6.8; V18 6.8,-6.8
DDR3-16 = smd 0.4 x 0.4: A1 -3.2,6; A2 -2.4,6; A3 -1.6,6; A7 1.6,6; A8 2.4,6; A9 3.2,6; B1 -3.2,5.2; B2 -2.4,5.2; B3 -1.6,5.2; B7 1.6,5.2; B8 2.4,5.2; B9 3.2,5.2; C1 -3.2,4.4; C2 -2.4,4.4; C3 -1.6,4.4; C7 1.6,4.4; C8 2.4,4.4; C9 3.2,4.4; D1 -3.2,3.6; D2 -2.4,3.6; D3 -1.6,3.6; D7 1.6,3.6; D8 2.4,3.6; D9 3.2,3.6; E1 -3.2,2.8; E2 -2.4,2.8; E3 -1.6,2.8; E7 1.6,2.8; E8 2.4,2.8; E9 3.2,2.8; F1 -3.2,2; F2 -2.4,2; F3 -1.6,2; F7 1.6,2; F8 2.4,2; F9 3.2,2; G1 -3.2,1.2; G2 -2.4,1.2; G3 -1.6,1.2; G7 1.6,1.2; G8 2.4,1.2; G9 3.2,1.2; H1 -3.2,0.4; H2 -2.4,0.4; H3 -1.6,0.4; H7 1.6,0.4; H8 2.4,0.4; H9 3.2,0.4; J1 -3.2,-0.4; J2 -2.4,-0.4; J3 -1.6,-0.4; J7 1.6,-0.4; J8 2.4,-0.4; J9 3.2,-0.4; K1 -3.2,-1.2; K2 -2.4,-1.2; K3 -1.6,-1.2; K7 1.6,-1.2; K8 2.4,-1.2; K9 3.2,-1.2; L1 -3.2,-2; L2 -2.4,-2; L3 -1.6,-2; L7 1.6,-2; L8 2.4,-2; L9 3.2,-2; M1 -3.2,-2.8; M2 -2.4,-2.8; M3 -1.6,-2.8; M7 1.6,-2.8; M8 2.4,-2.8; M9 3.2,-2.8; N1 -3.2,-3.6; N2 -2.4,-3.6; N3 -1.6,-3.6; N7 1.6,-3.6; N8 2.4,-3.6; N9 3.2,-3.6; P1 -3.2,-4.4; P2 -2.4,-4.4; P3 -1.6,-4.4; P7 1.6,-4.4; P8 2.4,-4.4; P9 3.2,-4.4; R1 -3.2,-5.2; R2 -2.4,-5.2; R3 -1.6,-5.2; R7 1.6,-5.2; R8 2.4,-5.2; R9 3.2,-5.2; T1 -3.2,-6; T2 -2.4,-6; T3 -1.6,-6; T7 1.6,-6; T8 2.4,-6; T9 3.2,-6

### Placement (x,y rotation side)
U1  -26.4,19.2 90 top  (outside the outline)
U2  -26.4,4.4 270 top  (outside the outline)

### Tracks (layer width: path | path; a pad name or v marks a point on that pad's centre or on a via)
DDR3_CLK_N  (via drill 0.25 pad 0.36)
  Top 0.127: U2.K7 -27.33,3.07 -27.33,3.6 v-27.49,3.6 | v-30.89,9.5 -30.73,9.8 -30.73,10.3 arc90 -30.95,10.52 arc-90 -31.16,10.74 -31.16,10.75 arc-90 -30.95,10.97 arc90 -30.73,11.19 -30.73,11.2 arc90 -30.95,11.42 -30.96,11.42 arc-90 -31.17,11.64 -31.17,11.66 arc-90 -30.96,11.88 -30.95,11.88 arc90 -30.73,12.1 -30.73,12.33 U1.D1
  Bottom 0.127: v-27.49,3.6 -27.33,3.6 -27.33,5.35 -30.73,8.75 -30.73,9.5 v-30.89,9.5
DDR3_CLK_P  (via drill 0.25 pad 0.36)
  Top 0.127: U2.J7 -27.07,3.07 -27.07,3.6 v-26.91,3.6 | v-30.31,9.5 -30.47,9.8 -30.47,12.13 -30.4,12.2 -30.4,12.8 U1.D2
  Bottom 0.127: v-26.91,3.6 -27.07,3.6 -27.07,5.45 -30.47,8.85 -30.47,9.5 v-30.31,9.5
DQ0  (1 unrouted)
DQ1  (1 unrouted)
DQ2  (1 unrouted)
DQ3  (1 unrouted)
DQ4  (1 unrouted)
DQ5  (1 unrouted)
DQ6  (1 unrouted)
DQ7  (1 unrouted)
DQ8  (1 unrouted)
DQ9  (1 unrouted)
DQ10  (1 unrouted)
DQ11  (1 unrouted)
DQ12  (1 unrouted)
DQ13  (1 unrouted)
DQ14  (1 unrouted)
DQ15  (1 unrouted)
SA0  (via drill 0.25 pad 0.36)
  Top 0.127: U1.F3 v-28.8,13.6 | U2.N3 v-29.6,6.4
  Route15 0.127: v-28.8,13.6 -28.3,13.1 -28.3,12 arc-90 -28.5,11.8 -28.8,11.8 arc90 -29,11.6 arc90 -28.8,11.4 -28.3,11.4 arc-90 -28.1,11.2 arc-90 -28.3,11 -28.8,11 arc90 -29,10.8 arc90 -28.8,10.6 -28.3,10.6 arc-90 -28.1,10.4 arc-90 -28.3,10.2 -28.8,10.2 arc90 -29,10 arc90 -28.8,9.8 -28.3,9.8 arc-90 -28.1,9.6 arc-90 -28.3,9.4 -28.7,9.4 arc90 -28.9,9.2 arc90 -28.7,9 -28.3,9 arc-90 -28.1,8.8 arc-90 -28.3,8.6 -28.7,8.6 arc90 -28.9,8.4 arc90 -28.7,8.2 -28.3,8.2 arc-90 -28.1,8 arc-90 -28.3,7.8 -28.7,7.8 arc90 -28.9,7.6 arc90 -28.7,7.4 -28.6,7.4 arc-90 -28.4,7.2 -28.4,6.6 -28.6,6.4 v-29.6,6.4
SA1  (via drill 0.25 pad 0.36)
  Top 0.127: U1.H1 v-27.2,12 | U2.P7 v-30.4,2.4
  Route15 0.127: v-30.4,2.4 -28.6,2.4 -28,3 -28,5.8 -27.5,6.3 -27.5,8.1 arc-90 -27.3,8.3 -27,8.3 arc90 -26.8,8.5 arc90 -27,8.7 -27.3,8.7 arc-90 -27.5,8.9 arc-90 -27.3,9.1 -27,9.1 arc90 -26.8,9.3 arc90 -27,9.5 -27.3,9.5 arc-90 -27.5,9.7 arc-90 -27.3,9.9 -27,9.9 arc90 -26.8,10.1 arc90 -27,10.3 -27.3,10.3 arc-90 -27.5,10.5 arc-90 -27.3,10.7 -27,10.7 arc90 -26.8,10.9 arc90 -27,11.1 -27.3,11.1 arc-90 -27.5,11.3 -27.5,11.7 v-27.2,12
SA2  (via drill 0.25 pad 0.36)
  Top 0.127: U2.P3 v-30.4,6.4 | U1.E4 v-29.6,14.4
  Route2 0.127: v-29.6,14.4 -29.2,14 -29.2,12.5 arc90 -29,12.3 -28.2,12.3 arc-90 -28,12.1 arc-90 -28.2,11.9 -29,11.9 arc90 -29.2,11.7 arc90 -29,11.5 -28.3,11.5 arc-90 -28.1,11.3 arc-90 -28.3,11.1 -29,11.1 arc90 -29.2,10.9 arc90 -29,10.7 -28.3,10.7 arc-90 -28.1,10.5 arc-90 -28.3,10.3 -29,10.3 arc90 -29.2,10.1 arc90 -29,9.9 -28.4,9.9 arc-90 -28.2,9.7 -28.2,9.6 arc-90 -28.4,9.4 -29,9.4 arc90 -29.2,9.2 -29.2,7.6 v-30.4,6.4
SA3  (via drill 0.25 pad 0.36)
  Top 0.127: U1.C3 v-31.2,13.6 | U2.N2 v-30.4,7.2
  Route15 0.127: v-31.2,13.6 -30.1,12.5 -30.1,11.9 arc90 -29.9,11.7 -29.6,11.7 arc-90 -29.4,11.5 arc-90 -29.6,11.3 -29.9,11.3 arc90 -30.1,11.1 arc90 -29.9,10.9 -29.6,10.9 arc-90 -29.4,10.7 arc-90 -29.6,10.5 -31.4,10.5 arc90 -31.6,10.3 arc90 -31.4,10.1 -29.8,10.1 arc-90 -29.6,9.9 -29.6,9.2 arc-90 -29.8,9 -30.3,9 arc90 -30.5,8.8 arc90 -30.3,8.6 -29.7,8.6 arc-90 -29.5,8.4 arc-90 -29.7,8.2 -30.3,8.2 arc90 -30.5,8 arc90 -30.3,7.8 -29.7,7.8 arc-90 -29.5,7.6 arc-90 -29.7,7.4 -30.2,7.4 v-30.4,7.2
SA4  (via drill 0.25 pad 0.36)
  Top 0.127: U1.C2 v-31.2,12.8 | U2.P8 v-31.2,2.4
  Route15 0.127: v-31.2,12.8 -31.2,12.3 arc90 -31,12.1 -30.6,12.1 arc-90 -30.4,11.9 arc-90 -30.6,11.7 -31.5,11.7 arc90 -31.7,11.5 arc90 -31.5,11.3 -30.6,11.3 arc-90 -30.4,11.1 arc-90 -30.6,10.9 -31.8,10.9 arc90 -32,10.7 -32,9.7 -30.8,8.5 -30.8,6 -31.2,5.6 -31.2,4.5 arc-90 -31.4,4.3 -31.6,4.3 arc90 -31.8,4.1 arc90 -31.6,3.9 -31.4,3.9 arc-90 -31.2,3.7 v-31.2,2.4
SA5  (via drill 0.25 pad 0.36)
  Top 0.127: U1.B1 v-32,12 | U2.P2 v-31.2,7.2
  Route15 0.127: v-32,12 -32,11.6 arc-90 -32.2,11.4 -33.6,11.4 arc90 -33.8,11.2 arc90 -33.6,11 -32.5,11 arc-90 -32.3,10.8 arc-90 -32.5,10.6 -33.6,10.6 arc90 -33.8,10.4 arc90 -33.6,10.2 -32.5,10.2 arc-90 -32.3,10 arc-90 -32.5,9.8 -33.5,9.8 arc90 -33.7,9.6 arc90 -33.5,9.4 -32.5,9.4 arc-90 -32.3,9.2 arc-90 -32.5,9 -33.4,9 arc90 -33.6,8.8 arc90 -33.4,8.6 -31.4,8.6 -31.2,8.4 v-31.2,7.2
SA6  (via drill 0.25 pad 0.36)
  Top 0.127: U1.D5 v-31.2,15.2 | U2.R8 v-32,1.6
  Route2 0.127: v-32,1.6 -32.7,1.6 -33.3,2.1 -33.3,2.9 arc-90 -33.1,3.1 -33,3.1 arc90 -32.8,3.3 arc90 -33,3.5 -33.1,3.5 arc-90 -33.3,3.7 -33.3,13.1 v-31.2,15.2
SA7  (via drill 0.25 pad 0.36)
  Top 0.127: U1.E2 v-29.6,12.8 | U2.R2 v-31.2,6.4
  Route2 0.127: v-31.2,6.4 -31.62,6.83 -31.62,7.38 -29.6,9.4 -29.6,10.1 arc90 -29.8,10.3 -31,10.3 arc-90 -31.2,10.5 arc-90 -31,10.7 -29.8,10.7 arc90 -29.6,10.9 arc90 -29.8,11.1 -31.1,11.1 arc-90 -31.3,11.3 arc-90 -31.1,11.5 -29.8,11.5 arc90 -29.6,11.7 arc90 -29.8,11.9 -31,11.9 arc-90 -31.2,12.1 arc-90 -31,12.3 -29.8,12.3 arc90 -29.6,12.5 v-29.6,12.8
SA8  (via drill 0.25 pad 0.36)
  Top 0.127: U2.T8 v-32,2.4 | U1.D4 v-31.2,14.4
  Bottom 0.127: v-31.2,14.4 -31.6,14 -31.6,10.7 -32,10.3 -32,8.2 -31.6,7.8 -31.6,5.5 arc90 -31.4,5.3 -31.05,5.3 arc-90 -30.85,5.1 arc-90 -31.05,4.9 -31.4,4.9 arc90 -31.6,4.7 arc90 -31.4,4.5 -31.05,4.5 arc-90 -30.85,4.3 arc-90 -31.05,4.1 -31.4,4.1 arc90 -31.6,3.9 arc90 -31.4,3.7 -31.05,3.7 arc-90 -30.85,3.5 arc-90 -31.05,3.3 -31.4,3.3 arc90 -31.6,3.1 -31.6,2.8 v-32,2.4
SA9  (via drill 0.25 pad 0.36)
  Top 0.127: U2.R3 v-32,6.4 | U1.C1 v-32,12.8
  Route2 0.127: v-32,12.8 -31.5,12.3 -31.5,11.7 arc-90 -31.7,11.5 -32.7,11.5 arc90 -32.9,11.3 arc90 -32.7,11.1 -31.8,11.1 arc-90 -31.6,10.9 arc-90 -31.8,10.7 -32.6,10.7 arc90 -32.8,10.5 arc90 -32.6,10.3 -31.8,10.3 arc-90 -31.6,10.1 arc-90 -31.8,9.9 -32.5,9.9 arc90 -32.7,9.7 arc90 -32.5,9.5 -31.8,9.5 arc-90 -31.6,9.3 arc-90 -31.8,9.1 -32.5,9.1 arc90 -32.7,8.9 arc90 -32.5,8.7 -31.8,8.7 arc-90 -31.6,8.5 arc-90 -31.8,8.3 -32.5,8.3 arc90 -32.7,8.1 arc90 -32.5,7.9 -32.2,7.9 -32,7.7 v-32,6.4
SA10  (via drill 0.25 pad 0.36)
  Top 0.127: U1.F4 v-28.8,14.4 | U2.L7 v-28,2.4
  Bottom 0.127: v-28,2.4 -26.6,2.4 -26.4,2.6 -26.4,5.7 -28,7.3 -28,8 arc90 -28.2,8.2 -28.3,8.2 arc-90 -28.5,8.4 arc-90 -28.3,8.6 -28.2,8.6 arc90 -28,8.8 arc90 -28.2,9 -28.3,9 arc-90 -28.5,9.2 arc-90 -28.3,9.4 -28.2,9.4 arc90 -28,9.6 arc90 -28.2,9.8 arc-90 -28.4,10 arc-90 -28.2,10.2 arc90 -28,10.4 -28,13.6 v-28.8,14.4
SA11  (via drill 0.25 pad 0.36)
  Top 0.127: U1.F2 v-28.8,12.8 | U2.R7 v-32,3.2
  Bottom 0.127: v-32,3.2 -32.4,3.6 -32.4,14 -31.6,14.8 -30.8,14.8 -30,14 -29.4,14 -29.2,13.8 -29.2,13.4 -28.8,13 v-28.8,12.8
SA12  (via drill 0.25 pad 0.36)
  Top 0.127: U1.E3 v-29.6,13.6 | U2.N7 v-30.4,3.2
  Bottom 0.127: v-30.4,3.2 U2.N7 -29.4,2.8 -29.2,3 -29.2,3.4 arc-90 -29,3.6 arc90 -28.8,3.8 arc90 -29,4 arc-90 -29.2,4.2 arc-90 -29,4.4 arc90 -28.8,4.6 arc90 -29,4.8 arc-90 -29.2,5 -29.2,5.2 -30,6 -30,7.5 -30.2,7.7 -30.6,7.7 -31.4,8.5 -31.4,9.8 -30.9,10.3 -30,10.3 -29.2,11.1 -29.2,11.6 arc90 -29.4,11.8 arc-90 -29.6,12 arc-90 -29.4,12.2 arc90 -29.2,12.4 -29.2,13 -29.6,13.4 v-29.6,13.6
SA13  (via drill 0.25 pad 0.36)
  Top 0.127: U1.H3 v-27.2,13.6 | U2.T3 v-32.8,6.4
  Route2 0.127: v-32.8,6.4 -32,5.6 -31.6,5.6 arc-90 -31.4,5.4 -31.4,5.3 arc90 -31.2,5.1 arc90 -31,5.3 -31,5.4 arc-90 -30.8,5.6 arc-90 -30.6,5.4 -30.6,5.3 arc90 -30.4,5.1 arc90 -30.2,5.3 -30.2,5.4 arc-90 -30,5.6 -26.6,5.6 -26.4,5.8 -26.4,12.8 v-27.2,13.6
SA14  (via drill 0.25 pad 0.36)
  Top 0.127: U1.H4 v-27.2,14.4 | U2.T7 v-32.8,2.4
  Route15 0.127: v-32.8,2.4 -32.4,2 -31,2 -30.8,2.2 -30.8,3.6 -27.8,6.6 -27.8,14.2 -27.6,14.4 v-27.2,14.4
SA15  (via drill 0.25 pad 0.36)
  Top 0.127: U1.D3 v-30.4,13.6 | U2.M7 v-29.6,3.2
  Bottom 0.127: v-29.6,3.2 -29.6,4.9 -30.8,6.1 -30.8,7.5 -31.7,8.4 -31.7,10.1 -31.1,10.7 -30.2,10.7 arc90 -30,10.9 arc90 -30.2,11.1 -30.7,11.1 arc-90 -30.9,11.3 arc-90 -30.7,11.5 -30.2,11.5 arc90 -30,11.7 arc90 -30.2,11.9 -30.7,11.9 arc-90 -30.9,12.1 arc-90 -30.7,12.3 -30.2,12.3 arc90 -30,12.5 arc90 -30.2,12.7 -30.6,12.7 arc-90 -30.8,12.9 -30.8,13.2 v-30.4,13.6